# Altium schematic sheet Controller_circuit.SchDoc: Controller circuit
size A4; Author: Thomas Carrington; DocumentNumber: 2; Revision: 2.1; SheetNumber: 2; SheetTotal: 8
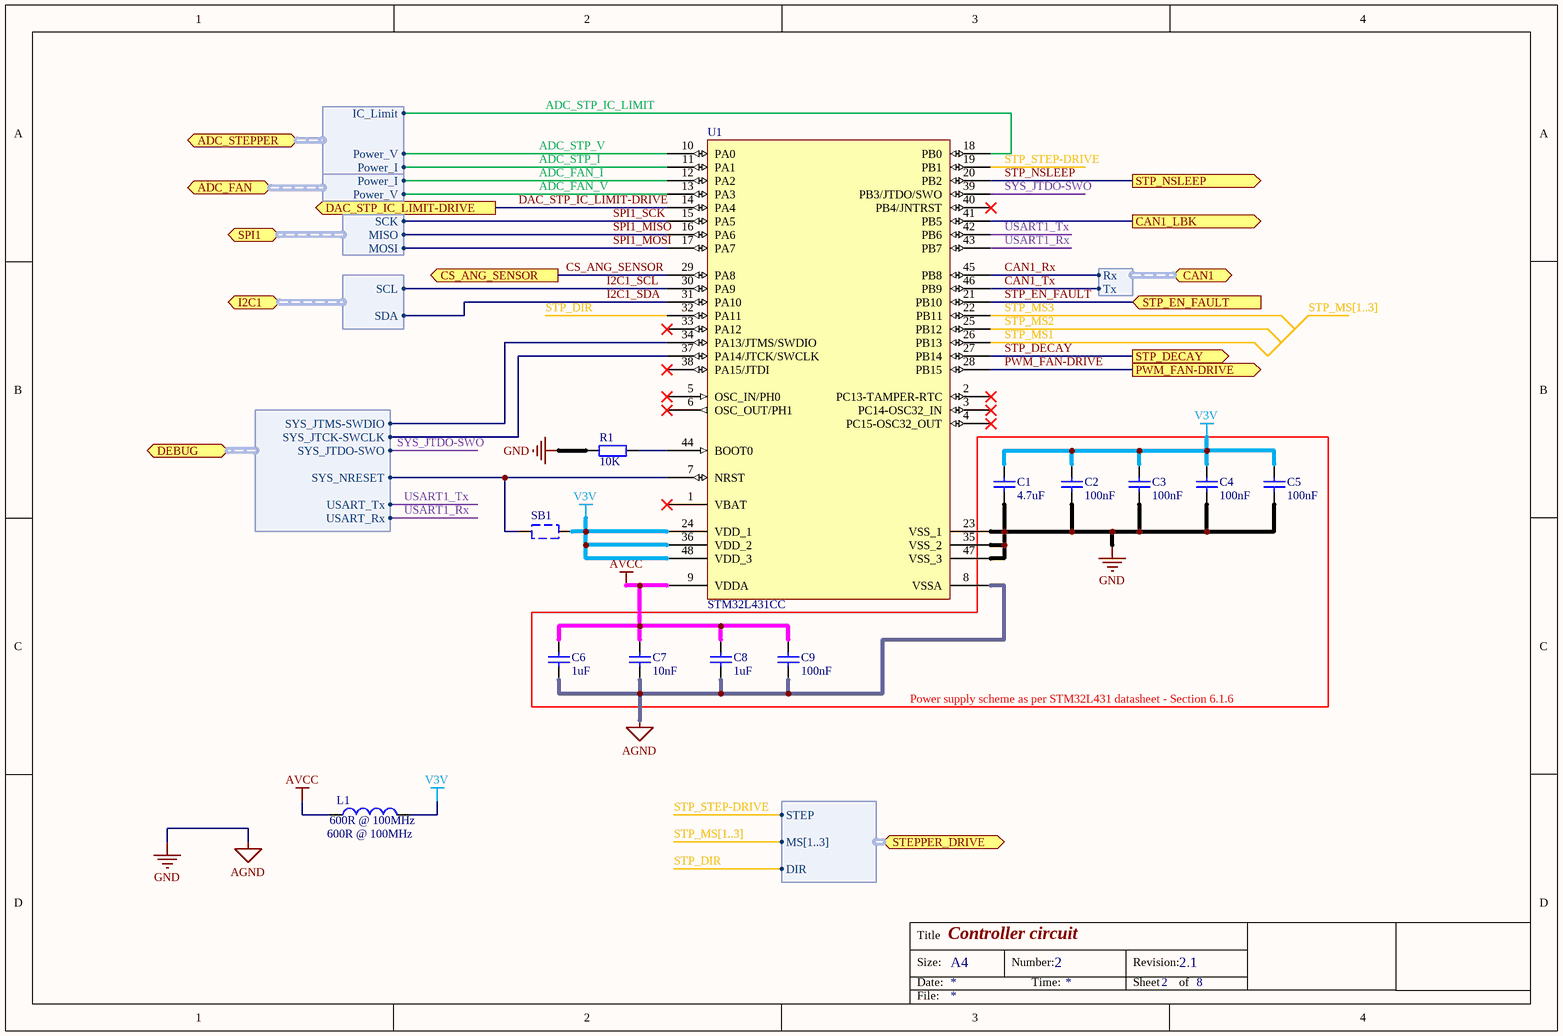
[diagram p0: Controller_circuit.SchDoc]

## Parts
C1  value 4.7uF  [CAPC1608X06N (0603)]  (hidden comment: Cap Semi)
C2  value 100nF  [CAPC1608X06N (0603)]  (hidden comment: Cap Semi)
C3  value 100nF  [CAPC1608X06N (0603)]  (hidden comment: Cap Semi)
C4  value 100nF  [CAPC1608X06N (0603)]  (hidden comment: Cap Semi)
C5  value 100nF  [CAPC1608X06N (0603)]  (hidden comment: Cap Semi)
C6  value 1uF  [CAPC1608X06N (0603)]  (hidden comment: Cap Semi)
C7  value 10nF  [CAPC1608X06N (0603)]  (hidden comment: Cap Semi)
C8  value 1uF  [CAPC1608X06N (0603)]  (hidden comment: Cap Semi)
C9  value 100nF  [CAPC1608X06N (0603)]  (hidden comment: Cap Semi)
L1  600R @ 100MHz  [INDC1608X06N]
R1  value 10K  [RESC1608X06N (0603)]  (hidden comment: Res)
SB1  Option_Res  [RESC1608X06N (0603)]  (value not drawn)
U1  STM32L431CC  [LQFP48_L]

## Ports
ADC_FAN (harness ADC_FAN), ADC_STEPPER (harness ADC_STEPPER), CAN1 (harness CAN_Harness), CAN1_LBK (out), CS_ANG_SENSOR (out), DAC_STP_IC_LIMIT-DRIVE (out), DEBUG (harness Debug_Harness), I2C1 (harness I2C_Harness), PWM_FAN-DRIVE (out), SPI1 (harness SPI_Harness), STEPPER_DRIVE (harness STEPPER_DRIVE), STP_DECAY (out), STP_EN_FAULT (in), STP_NSLEEP (out)

## Harnesses
Debug_Harness: SYS_NRESET, SYS_JTCK-SWCLK, SYS_JTMS-SWDIO, USART_Tx, USART_Rx, SYS_JTDO-SWO
I2C_Harness: SCL, SDA
CAN_Harness: Tx, Rx
ADC_STEPPER: Power_V, Power_I, IC_Limit
ADC_FAN: Power_V, Power_I
STEPPER_DRIVE: STEP, MS[1..3], DIR
SPI_Harness: SCK, MISO, MOSI

## Nets
AGND: C1.1 C2.1 C3.1 C4.1 C5.1 C6.1 C7.1 C8.1 C9.1 R1.1 U1.8(VSSA) U1.23(VSS_1) U1.35(VSS_2) U1.47(VSS_3)  [also labelled GND]
AVCC: C6.2 C7.2 C8.2 C9.2 L1.1 U1.9(VDDA)
V3V: C1.2 C2.2 C3.2 C4.2 C5.2 L1.2 SB1.2 U1.24(VDD_1) U1.36(VDD_2) U1.48(VDD_3)
ADC_FAN_I: U1.12(PA2) ; port ADC_FAN.Power_I
ADC_FAN_V: U1.13(PA3) ; port ADC_FAN.Power_V
ADC_STP_I: U1.11(PA1) ; port ADC_STEPPER.Power_I
ADC_STP_IC_LIMIT: U1.18(PB0) ; port ADC_STEPPER.IC_Limit
ADC_STP_V: U1.10(PA0) ; port ADC_STEPPER.Power_V
CAN1_LBK: U1.41(PB5) ; port CAN1_LBK
CAN1_Rx: U1.45(PB8) ; port CAN1.Rx
CAN1_Tx: U1.46(PB9) ; port CAN1.Tx
CS_ANG_SENSOR: U1.29(PA8) ; port CS_ANG_SENSOR
DAC_STP_IC_LIMIT-DRIVE: U1.14(PA4) ; port DAC_STP_IC_LIMIT-DRIVE
I2C1_SCL: U1.30(PA9) ; port I2C1.SCL
I2C1_SDA: U1.31(PA10) ; port I2C1.SDA
PWM_FAN-DRIVE: U1.28(PB15) ; port PWM_FAN-DRIVE
SPI1_MISO: U1.16(PA6) ; port SPI1.MISO
SPI1_MOSI: U1.17(PA7) ; port SPI1.MOSI
SPI1_SCK: U1.15(PA5) ; port SPI1.SCK
STP_DECAY: U1.27(PB14) ; port STP_DECAY
STP_DIR: U1.32(PA11) ; port STEPPER_DRIVE.DIR
STP_EN_FAULT: U1.21(PB10) ; port STP_EN_FAULT
STP_MS1: U1.26(PB13)
STP_MS2: U1.25(PB12)
STP_MS3: U1.22(PB11)
STP_NSLEEP: U1.20(PB2) ; port STP_NSLEEP
STP_STEP-DRIVE: U1.19(PB1) ; port STEPPER_DRIVE.STEP
SYS_JTDO-SWO: U1.39(PB3/JTDO/SWO) ; port DEBUG.SYS_JTDO-SWO
USART1_Rx: U1.43(PB7) ; port DEBUG.USART_Rx
USART1_Tx: U1.42(PB6) ; port DEBUG.USART_Tx
NetR1_2: R1.2 U1.44(BOOT0)
NetSB1_1: SB1.1 U1.7(NRST) ; port DEBUG.SYS_NRESET
NetU1_34: U1.34(PA13/JTMS/SWDIO) ; port DEBUG.SYS_JTMS-SWDIO
NetU1_37: U1.37(PA14/JTCK/SWCLK) ; port DEBUG.SYS_JTCK-SWCLK

Not connected (* = marked no-connect by the designer): U1 1(VBAT)* 2(PC13-TAMPER-RTC)* 3(PC14-OSC32_IN)* 4(PC15-OSC32_OUT)* 5(OSC_IN/PH0)* 6(OSC_OUT/PH1)* 33(PA12)* 38(PA15/JTDI)* 40(PB4/JNTRST)*

## Buses and harness runs
bus STP_MS[1..3]

## Notes on the sheet
- (near C6) Tantalum or Ceramic Capacitor
  (1uF)
- (near C7) Ceramic Capacitor
  (10nF)
- Power supply scheme as per STM32L431 datasheet - Section 6.1.6
- Title
- Size:
- Date:
- A4
- Number:
- Time:
- Revision:
- Sheet
- of
- File:

## Library data of the parts
C1-C9 = Cap Semi: Capacitor (Semiconductor SIM Model); Published: 8-Jun-2000; LatestRevisionDate: 29-May-2009; LatestRevisionNote: IPC-7351 Footprint Added.; PackageReference: X7R; Publisher: Altium Limited; PackageDescription: Chip Capacitor
L1 = Ferrite Bead: Inductor with ferrite bead; Farnell_Product: https://uk.farnell.com/tdk/mmz1608b601ct/ferrite-bead-600r-0-5a-0603/dp/2800753; Value: 600R @ 100MHz
R1 = Res: Resistor; Published: 8-Jun-2000; LatestRevisionDate: 17-Jul-2002; LatestRevisionNote: Re-released for DXP Platform.; PackageReference: MCWR06; Publisher: Altium Limited; PackageDescription: SMD Chip Resistor
SB1 = Option_Resistor: Resistor; Published: 8-Jun-2000; LatestRevisionDate: 17-Jul-2002; LatestRevisionNote: Re-released for DXP Platform.; PackageReference: MCWR06; Publisher: Altium Limited; PackageDescription: SMD Chip Resistor
U1 = STM32L431CC: STM32 ARM-based 32-bit MCU with 32 Kbytes Flash, 48-pin LQFP, Industrial Temperature; Published: 30-May-2008; DatasheetVersion: rev6, Mar-2008; PackageVersion: Mar-2008; PackageReference: LQFP48; Publisher: Altium Limited; PackageDescription: 48-Pin Low-Profile Quad Flat Pack, 7 x 7 mm Body, 0.5 mm Pitch (LQFP48); ComponentLink1Description: Manufacturer Link; ComponentLink1URL: www.st.com/stm32; ComponentLink2Description: Datasheet; ComponentLink2URL: https://www.st.com/resource/en/datasheet/stm32l431cb.pdf